# Altium schematic sheet FPGA PWR.SchDoc: XC7A3G-POWER
size A4; Date: 9 AUG 2026; Engineer: Parsa Malekpour; Revision: 1.0.0; SheetNumber: 8; SheetTotal: 18
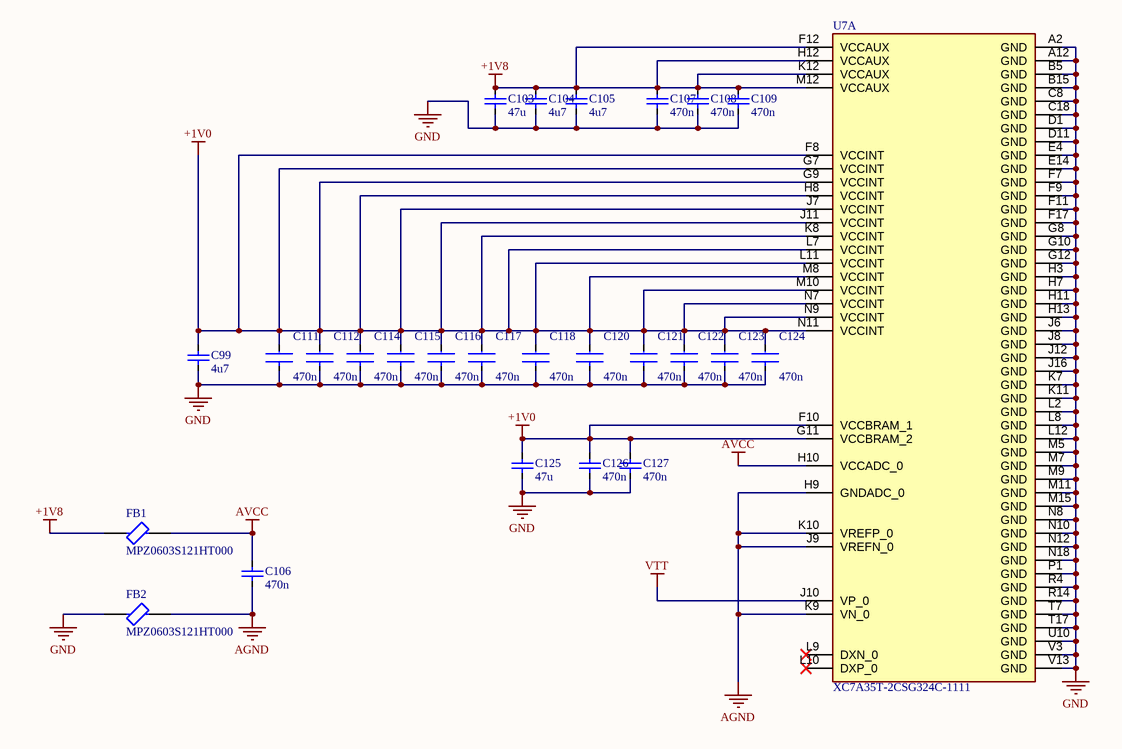
[diagram p0: FPGA PWR.SchDoc]

## Parts
C99  value 4u7  [FP-C1005-050-0_20-0_10-IPC_C]  (hidden comment: C1005X5R1A475K050BE)
C103  value 47u  [FP-C2012-125-0_2-IPC_C]  (hidden comment: C2012X5R1A476M125AC)
C104  value 4u7  [FP-C1005-050-0_20-0_10-IPC_C]  (hidden comment: C1005X5R1A475K050BE)
C105  value 4u7  [FP-C1005-050-0_20-0_10-IPC_C]  (hidden comment: C1005X5R1A475K050BE)
C106  value 470n  [FP-C1005-050-0_05-IPC_C]  (hidden comment: C1005X5R1E474K050BB)
C107  value 470n  [FP-C1005-050-0_05-IPC_C]  (hidden comment: C1005X5R1E474K050BB)
C108  value 470n  [FP-C1005-050-0_05-IPC_C]  (hidden comment: C1005X5R1E474K050BB)
C109  value 470n  [FP-C1005-050-0_05-IPC_C]  (hidden comment: C1005X5R1E474K050BB)
C111  value 470n  [FP-C1005-050-0_05-IPC_C]  (hidden comment: C1005X5R1E474K050BB)
C112  value 470n  [FP-C1005-050-0_05-IPC_C]  (hidden comment: C1005X5R1E474K050BB)
C114  value 470n  [FP-C1005-050-0_05-IPC_C]  (hidden comment: C1005X5R1E474K050BB)
C115  value 470n  [FP-C1005-050-0_05-IPC_C]  (hidden comment: C1005X5R1E474K050BB)
C116  value 470n  [FP-C1005-050-0_05-IPC_C]  (hidden comment: C1005X5R1E474K050BB)
C117  value 470n  [FP-C1005-050-0_05-IPC_C]  (hidden comment: C1005X5R1E474K050BB)
C118  value 470n  [FP-C1005-050-0_05-IPC_C]  (hidden comment: C1005X5R1E474K050BB)
C120  value 470n  [FP-C1005-050-0_05-IPC_C]  (hidden comment: C1005X5R1E474K050BB)
C121  value 470n  [FP-C1005-050-0_05-IPC_C]  (hidden comment: C1005X5R1E474K050BB)
C122  value 470n  [FP-C1005-050-0_05-IPC_C]  (hidden comment: C1005X5R1E474K050BB)
C123  value 470n  [FP-C1005-050-0_05-IPC_C]  (hidden comment: C1005X5R1E474K050BB)
C124  value 470n  [FP-C1005-050-0_05-IPC_C]  (hidden comment: C1005X5R1E474K050BB)
C125  value 47u  [FP-C2012-125-0_2-IPC_C]  (hidden comment: C2012X5R1A476M125AC)
C126  value 470n  [FP-C1005-050-0_05-IPC_C]  (hidden comment: C1005X5R1E474K050BB)
C127  value 470n  [FP-C1005-050-0_05-IPC_C]  (hidden comment: C1005X5R1E474K050BB)
FB1  MPZ0603S121HT000  [FP-MPZ0603-IPC_C]
FB2  MPZ0603S121HT000  [FP-MPZ0603-IPC_C]
U7  XC7A35T-2CSG324C-1111  [BGA324C80P18X18_1500X1500X150]  (part A of 8)

## Nets
+1V0: C99.1 C111.2 C112.2 C114.2 C115.2 C116.2 C117.2 C118.2 C120.2 C121.2 C122.2 C123.2 C124.2 C125.1 C126.1 C127.1 U7.F8(VCCINT) U7.F10(VCCBRAM_1) U7.G7(VCCINT) U7.G9(VCCINT) U7.G11(VCCBRAM_2) U7.H8(VCCINT) U7.J7(VCCINT) U7.J11(VCCINT) U7.K8(VCCINT) U7.L7(VCCINT) U7.L11(VCCINT) U7.M8(VCCINT) U7.M10(VCCINT) U7.N7(VCCINT) U7.N9(VCCINT) U7.N11(VCCINT)
+1V8: C103.1 C104.1 C105.1 C107.1 C108.1 C109.1 FB1.1 U7.F12(VCCAUX) U7.H12(VCCAUX) U7.K12(VCCAUX) U7.M12(VCCAUX)
AGND: C106.2 FB2.2 U7.H9(GNDADC_0) U7.J9(VREFN_0) U7.K9(VN_0) U7.K10(VREFP_0)
AVCC: C106.1 FB1.2 U7.H10(VCCADC_0)
GND: C99.2 C103.2 C104.2 C105.2 C107.2 C108.2 C109.2 C111.1 C112.1 C114.1 C115.1 C116.1 C117.1 C118.1 C120.1 C121.1 C122.1 C123.1 C124.1 C125.2 C126.2 C127.2 FB2.1 U7.A2(GND) U7.A12(GND) U7.B5(GND) U7.B15(GND) U7.C8(GND) U7.C18(GND) U7.D1(GND) U7.D11(GND) U7.E4(GND) U7.E14(GND) U7.F7(GND) U7.F9(GND) U7.F11(GND) U7.F17(GND) U7.G8(GND) U7.G10(GND) U7.G12(GND) U7.H3(GND) U7.H7(GND) U7.H11(GND) U7.H13(GND) U7.J6(GND) U7.J8(GND) U7.J12(GND) U7.J16(GND) U7.K7(GND) U7.K11(GND) U7.L2(GND) U7.L8(GND) U7.L12(GND) U7.M5(GND) U7.M7(GND) U7.M9(GND) U7.M11(GND) U7.M15(GND) U7.N8(GND) U7.N10(GND) U7.N12(GND) U7.N18(GND) U7.P1(GND) U7.R4(GND) U7.R14(GND) U7.T7(GND) U7.T17(GND) U7.U10(GND) U7.V3(GND) U7.V13(GND)
VTT: U7.J10(VP_0)

Not connected (* = marked no-connect by the designer): U7 L9(DXN_0)* L10(DXP_0)*

## Notes on the sheet
- TITLE
- REV
- Date
- A4
- FILE NAME
- CODE
- SHEET
- Engineer
- OF

## Library data of the parts
C99 = C1005X5R1A475K050BE: 4.7UF 10V X5R 0402; Tolerance: 10%; Max Operating Temperature: 85°C; Case Code (Metric): 1005; Voltage Rating: 10V; Packaging: Tape and Reel; Case/Package: 0402; Features: Soft Termination; Min Operating Temperature: -55°C; Mount: Surface Mount; Case Code (Imperial): 0402; RoHS Compliant: Yes; Part Number: C1005X5R1A475K050BE
C103 C125 = C2012X5R1A476M125AC: MLCC 47μF ±20% 10V X5R SMD 0805 Multilayer Ceramic Capacitors; RoHS Compliant: Yes; Dielectric: X5R; Case Code (Imperial): 0805; Min Operating Temperature: -55°C; Length: 2mm; Voltage Rating: 10V; Lead Free: Lead Free; Weight: 0.000194oz; Resistor Type: Ceramic; Dielectric Material: Ceramic; Max Operating Temperature: 85°C; Height: 1.25mm; Width: 0.049inch; Depth: 1.25mm; Termination: SMD/SMT; Case/Package: 0805; Voltage Rating (DC): 10V; Voltage: 10V; Thickness: 0.057inch; Tolerance: 20%; REACH SVHC: No SVHC; Package Quantity: 1; Series: C; Case Code (Metric): 2012; Mount: Surface Mount; Packaging: Tape and Reel; Part Number: C2012X5R1A476M125AC
C104 C105 = C1005X5R1A475K050BE: MLCC  4.7UF ±20 10V X5R 0402; Tolerance: 10%; Max Operating Temperature: 85°C; Case Code (Metric): 1005; Voltage Rating: 10V; Packaging: Tape and Reel; Case/Package: 0402; Features: Soft Termination; Min Operating Temperature: -55°C; Mount: Surface Mount; Case Code (Imperial): 0402; RoHS Compliant: Yes; Part Number: C1005X5R1A475K050BE
C106-C109 C126 C127 = C1005X5R1E474K050BB: MLCC 470nF ±10% 25V X5R SMD 0402; Dielectric Material: Ceramic; Dissipation Factor: 10%; Case Code (Metric): 1005; RoHS Compliant: Yes; Lead Free: Lead Free; Length: 1mm; Case/Package: 0402; Termination: SMD/SMT; Dielectric: X5R; Depth: 0.5mm; Series: C; Voltage: 25V; Tolerance: 10%; Packaging: Tape and Reel; Resistor Type: Ceramic; Min Operating Temperature: -55°C; Width: 0.02inch; Thickness: 500um; Package Quantity: 10000; Case Code (Imperial): 0402; Construction: Flat; Height: 0.5mm; REACH SVHC: No SVHC; Radiation Hardening: No; Weight: 2.3E-05oz; Mount: Surface Mount; Voltage Rating (DC): 25V; Max Operating Temperature: 85°C; Part Number: C1005X5R1E474K050BB; Voltage Rating: 25V
C111 C112 C114-C118 C120-C124 = CMP-2000-06003-2: Multilayer Ceramic Capacitors 470nF ±10% 25V X5R SMD 0402; Dissipation Factor: 10%; Case Code (Metric): 1005; RoHS Compliant: Yes; Lead Free: Lead Free; Length: 1mm; Case/Package: 0402; Termination: SMD/SMT; Voltage Rating: 25V; Dielectric Material: Ceramic; Dielectric: X5R; Depth: 0.5mm; Series: C; Voltage: 25V; Tolerance: 10%; Packaging: Tape and Reel; Resistor Type: Ceramic; Min Operating Temperature: -55°C; Width: 0.02inch; Thickness: 500um; Package Quantity: 10000; Case Code (Imperial): 0402; Construction: Flat; Height: 0.5mm; REACH SVHC: No SVHC; Radiation Hardening: No; Weight: 2.3E-05oz; Mount: Surface Mount; Voltage Rating (DC): 25V; Max Operating Temperature: 85°C; Part Number: C1005X5R1E474K050BB
FB1 FB2 = MPZ0603S121HT000: CHIP BEADS FOR GENERAL SIGNAL LI; Max Current Rating: 1A; DC Resistance (DCR): 130mR; Number of Lines: 1; Min Operating Temperature: -55°C; Mount: Surface Mount; Case Code (Imperial): 0201; Case Code (Metric): 0603; Max Operating Temperature: 125°C; RoHS Compliant: Yes; Packaging: Cut Tape; Case/Package: 0201
U7 = XC7A35T-2CSG324C-1111: Integrated Circuit; Manufacturer_Name: AMD; Datasheet Link: https://www.xilinx.com/support/documentation/data_sheets/ds181_Artix_7_Data_Sheet.pdf; Height: 1.5mm; Manufacturer_Part_Number: XC7A35T-2CSG324C; Mouser Part Number: 217-XC7A35T-2CSG324C; Mouser Price/Stock: https://www.mouser.co.uk/ProductDetail/AMD-Xilinx/XC7A35T-2CSG324C?qs=rrS6PyfT74fMA9%2F3WtPZmw%3D%3D